# EAGLE design Optostop (EAGLE 8.3.2)
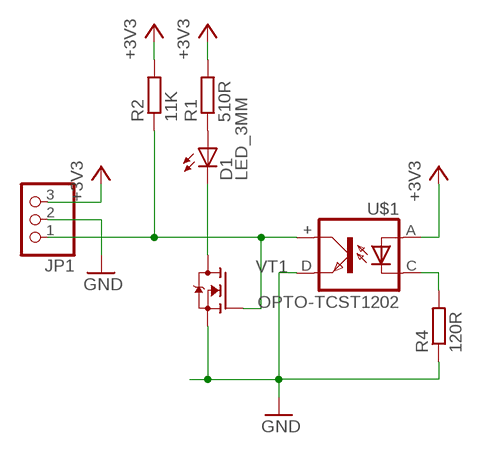
[diagram p0: schematic, sheet 1]

## Parts
D1  LED_3MM  [LED3MM]
JP1  PINHD-1X3/90  [1X03/90]
R1  510R  R_0805  [R0805]
R2  11K  R_0805  [R0805]
R4  120R  R_0805  [R0805]
U$1  OPTO-TCST1202  [TCST1202]
VT1  FET-NSOT-23  [SOT23]

## Nets
+3V3: JP1.3 R1.2 R2.2 U$1.A
GND: JP1.2 R4.1 U$1.D(EMIT) VT1.2(S)
N$1: D1.A R1.1
N$2: JP1.1 R2.1 U$1.+(COL) VT1.1(G)
N$3: D1.K(C) VT1.3(D)
N$4: R4.2 U$1.C

## Library data of the parts
D1 = Namenlos:LED_
JP1 = pinhead:PINHD-1X3: PIN HEADER
R1 R2 R4 = Namenlos:R_
U$1 = Namenlos:OPTO-TCST1202
VT1 = Namenlos:FET-N

## Board
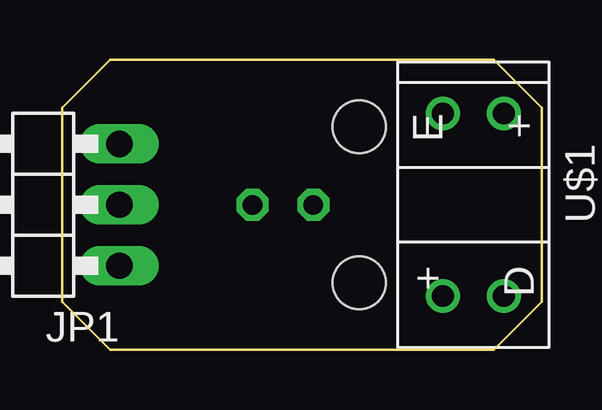
[diagram p1: board, top side]
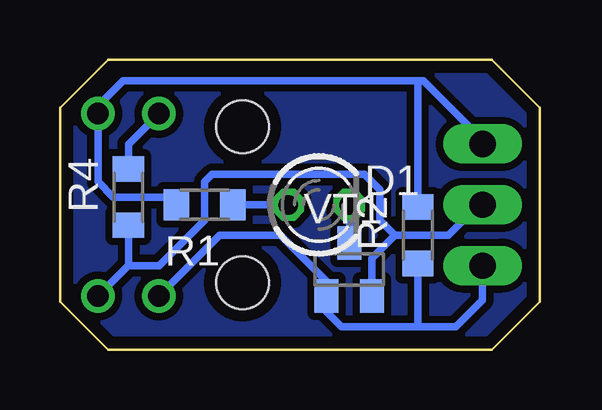
[diagram p2: board, bottom side, seen from below]

Size 20 x 12.06 mm. Coordinates in mm from the lower left corner, seen from the top.
Outline: 0,2 0,10.06 2,12.06 18,12.06 20,10.06 20,2 18,0 2,0 0,2
Copper layers (1*16): Top 0.035mm / dielectric 1.5mm / Bottom 0.035mm
Design rules "EagleDesignRules": minimum track width 0.2mm, minimum drill 0.3mm, track to track 0.2mm, track to pad 0.2mm, pad to pad 0.2mm, via to via 0.2mm, smd to smd 0.2mm, copper to edge 0.5mm, drill to drill 0.2mm, minimum pad ring 10mil, minimum via ring 8mil, stop-mask expansion 4mil, vias tented up to drill 0mil, thermal gap 0.25mm
Holes 2.2 mm at 12.38,9.28 12.38,2.78

### Footprints (pad centres in the part's own frame; a part is rotated, then mirrored left to right if it is on the bottom)
LED3MM = drill 0.813 octagon: A -1.27,0; K 1.27,0
1X03/90 = drill 1.1 long: 1 -2.54,-3.81; 2 0,-3.81; 3 2.54,-3.81
R0805 = smd 1.05 x 1.3: 1 -1.175,0; 2 1.175,0
TCST1202 = drill 0.9: + 3.8,-1.27; A -3.8,1.27; C -3.8,-1.27; D 3.8,1.27
SOT23 = smd 1 x 1.4: 1 -0.95,-1.1; 2 0.95,-1.1; 3 0,1.1

### Placement (x,y rotation side)
D1  9.21,6.03 0 bottom
JP1  -1.43,6.03 90 top
R1  13.97,6.03 180 bottom
R2  5.08,4.76 90 bottom
R4  17.14,6.35 90 bottom
U$1  17.14,6.03 270 top
VT1  7.94,3.33 0 bottom

### Tracks (layer width: path | path; a pad name or v marks a point on that pad's centre or on a via)
+3V3
  Bottom 0.305: R1.2 15.46,6.35 17.78,6.35 18.42,6.99 U$1.A 18.42,10.16 17.37,11.2 5.08,11.2 | 5.08,11.2 4.85,11.2 2.22,8.57 JP1.3 | R2.2 5.08,11.2
GND
  Bottom 0.305: 17.16,3.49 U$1.D | JP1.2 2.54,6.03 3.81,4.76 6.03,4.76 | 6.03,4.76 6.99,3.81 VT1.2 | 6.03,4.76 6.67,5.4 6.67,6.67 7.3,7.3 13.65,7.3 13.97,6.99 13.97,5.4 15.87,3.49 17.16,3.49 | R4.1 17.14,3.5 17.16,3.49
N$1
  Bottom 0.305: D1.A R1.1
N$2
  Bottom 0.305: U$1.+ 13.35,4.76 10.8,4.76 8.89,2.85 VT1.1 8.89,1.59 8.25,0.95 5.08,0.95 | JP1.1 2.38,2.06 3.49,0.95 5.08,0.95 | R2.1 5.08,0.95
N$3
  Bottom 0.305: D1.K VT1.3
N$4
  Bottom 0.305: R4.2 17.14,8.56 U$1.C
N$5
  pour Bottom (isolate 0.305): 0,10.16 0,2 2,0 18.1,0 20,1.9 20,10.16 18.1,12.06 1.91,12.06